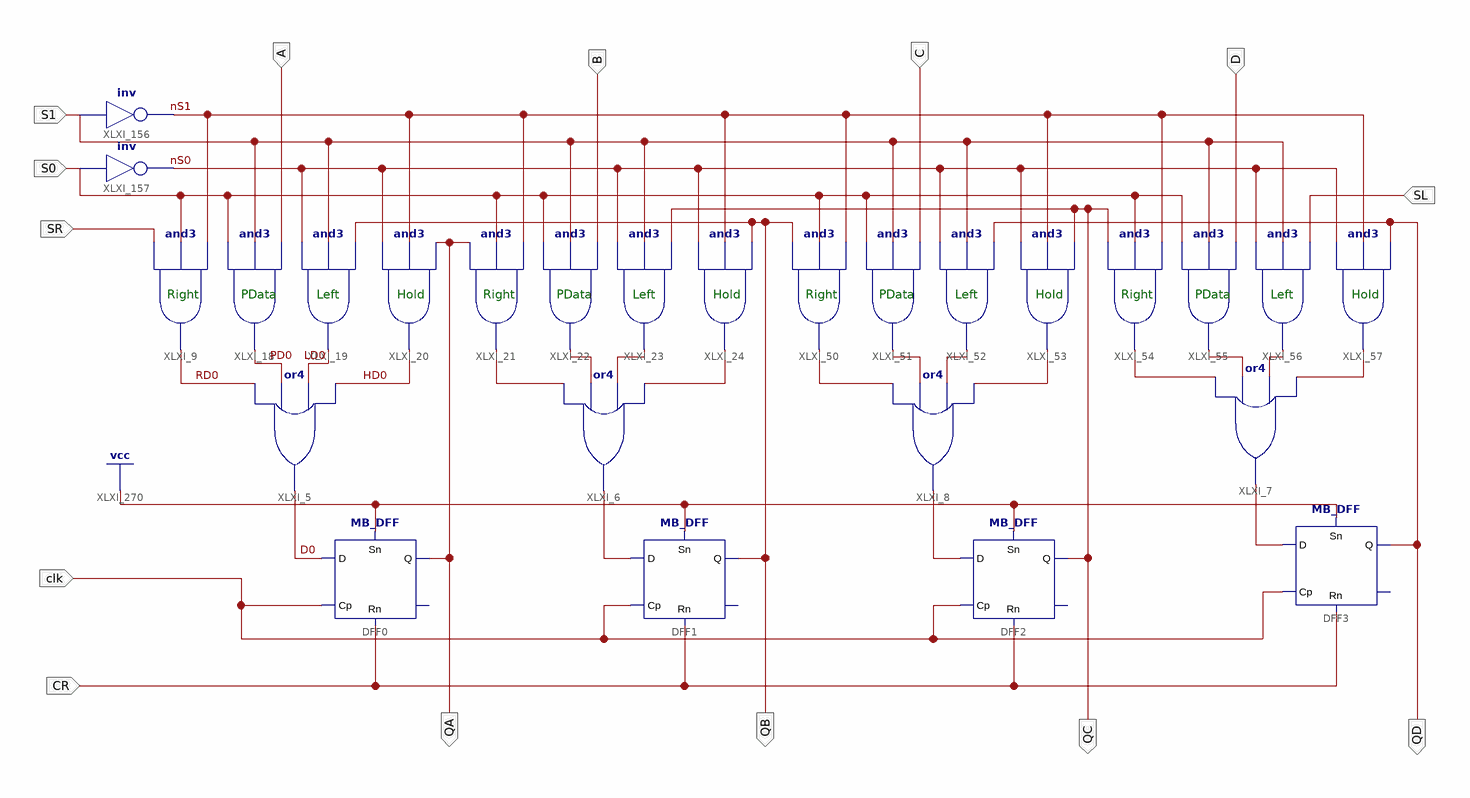
[diagram p0: schematic sheet 1]
// Xilinx ISE schematic SN74LS194.sch (kintex7) as structural Verilog: 26 symbols, 14 ports
module SN74LS194 (
  input  SR,
  input  A,
  input  S1,
  input  B,
  input  C,
  input  D,
  input  S0,
  input  SL,
  input  CR,
  input  clk,
  output QA,
  output QB,
  output QC,
  output QD
);

  wire D0, HD0, LD0, nS0, nS1, PD0, RD0, XLXN_2, XLXN_3, XLXN_4, XLXN_43, XLXN_44, XLXN_45, XLXN_46, XLXN_92,
       XLXN_93, XLXN_94, XLXN_95, XLXN_106, XLXN_107, XLXN_108, XLXN_109;

  and XLXI_18 (PD0, S0, S1, A);
  and XLXI_19 (LD0, nS0, S1, QB);
  and XLXI_20 (HD0, nS0, nS1, QA);
  and XLXI_21 (XLXN_43, QA, S0, nS1);
  and XLXI_22 (XLXN_44, S0, S1, B);
  and XLXI_23 (XLXN_45, nS0, S1, QC);
  and XLXI_24 (XLXN_46, nS0, nS1, QB);
  and XLXI_50 (XLXN_92, QB, S0, nS1);
  and XLXI_51 (XLXN_93, S0, S1, C);
  and XLXI_52 (XLXN_94, nS0, S1, QD);
  and XLXI_53 (XLXN_95, nS0, nS1, QC);
  and XLXI_54 (XLXN_106, QC, S0, nS1);
  and XLXI_55 (XLXN_107, S0, S1, D);
  and XLXI_56 (XLXN_108, nS0, S1, SL);
  and XLXI_57 (XLXN_109, nS0, nS1, QD);
  and XLXI_9 (RD0, SR, S0, nS1);
  or XLXI_5 (D0, RD0, PD0, LD0, HD0);
  or XLXI_6 (XLXN_2, XLXN_43, XLXN_44, XLXN_45, XLXN_46);
  not XLXI_157 (nS0, S0);
  not XLXI_156 (nS1, S1);
  or XLXI_8 (XLXN_3, XLXN_92, XLXN_93, XLXN_94, XLXN_95);
  MB_DFF DFF1 (.Cp(clk), .D(XLXN_2), .Q(QB), .Sn(1'b1), .Rn(CR));  // open: Qn
  MB_DFF DFF2 (.Cp(clk), .D(XLXN_3), .Q(QC), .Sn(1'b1), .Rn(CR));  // open: Qn
  MB_DFF DFF0 (.Cp(clk), .D(D0), .Q(QA), .Sn(1'b1), .Rn(CR));  // open: Qn
  MB_DFF DFF3 (.Cp(clk), .D(XLXN_4), .Q(QD), .Sn(1'b1), .Rn(CR));  // open: Qn
  or XLXI_7 (XLXN_4, XLXN_106, XLXN_107, XLXN_108, XLXN_109);

  // Notes on the sheet:
  //   Right
  //   PData
  //   Left
  //   Hold
  //   Right
  //   PData
  //   Left
  //   Hold
  //   Right
  //   PData
  //   Left
  //   Hold
  //   Right
  //   PData
  //   Left
  //   Hold
endmodule
